# EAGLE design RelayBoard1.0 (EAGLE 7.4.0)
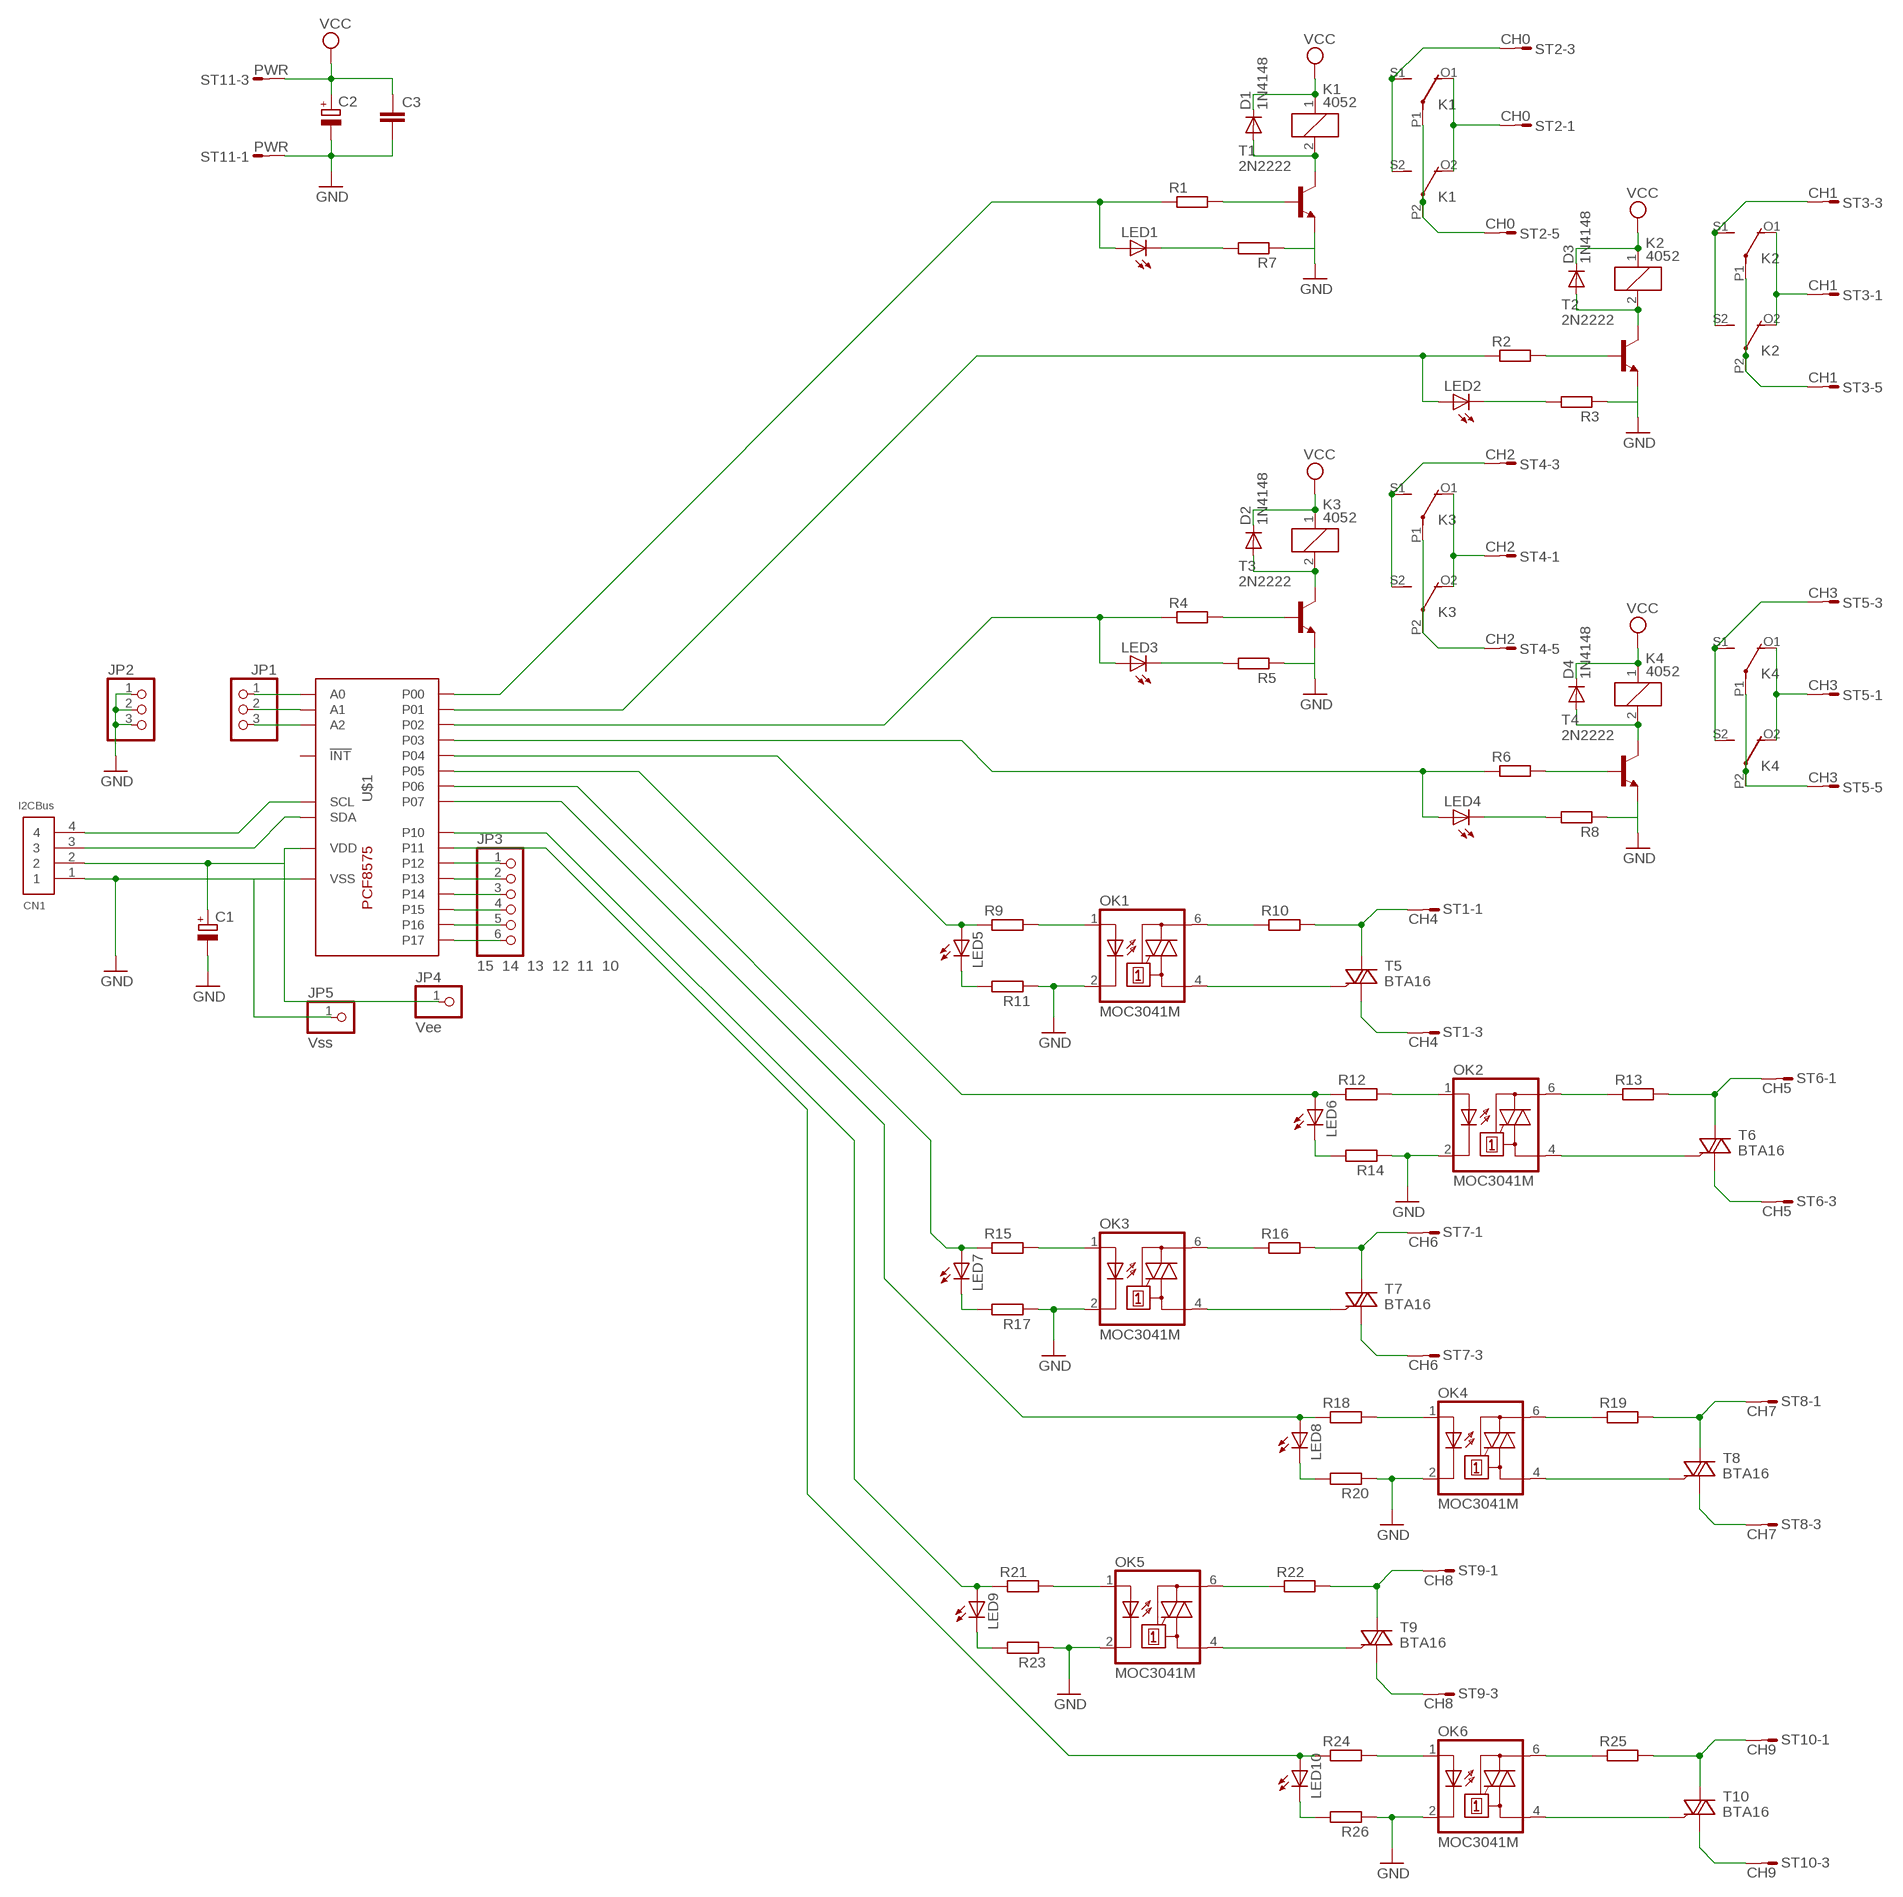
[diagram p0: schematic, sheet 1]

## Parts
C1  CPOL-EUE3.5-8  [E3,5-8]
C2  CPOL-EUE2.5-7  [E2,5-7]
C3  C-EU050-025X075  [C050-025X075]
CN1  I2CBus  1X4-BIG  [1X04-BIG]
D1  1N4148  1N4148DO35-7  [DO35-7]
D2  1N4148  1N4148DO35-7  [DO35-7]
D3  1N4148  1N4148DO35-7  [DO35-7]
D4  1N4148  1N4148DO35-7  [DO35-7]
JP1  PINHD-1X3  [1X03]
JP2  PINHD-1X3  [1X03]
JP3  15 14 13 12 11 10  PINHD-1X6CB  [1X06-CLEANBIG]
JP4  Vee  PINHD-1X1CB  [1X01-CLEANBIG]
JP5  Vss  PINHD-1X1CB  [1X01-CLEANBIG]
K1  4052  [F4052]
K2  4052  [F4052]
K3  4052  [F4052]
K4  4052  [F4052]
LED1  LED3MM  [LED3MM]
LED2  LED3MM  [LED3MM]
LED3  LED3MM  [LED3MM]
LED4  LED3MM  [LED3MM]
LED5  LEDCHIPLED_0805  [CHIPLED_0805]
LED6  LEDCHIPLED_0805  [CHIPLED_0805]
LED7  LEDCHIPLED_0805  [CHIPLED_0805]
LED8  LEDCHIPLED_0805  [CHIPLED_0805]
LED9  LEDCHIPLED_0805  [CHIPLED_0805]
LED10  LEDCHIPLED_0805  [CHIPLED_0805]
OK1  MOC3041M  [DIL06]
OK2  MOC3041M  [DIL06]
OK3  MOC3041M  [DIL06]
OK4  MOC3041M  [DIL06]
OK5  MOC3041M  [DIL06]
OK6  MOC3041M  [DIL06]
R1  R-EU_0204/7  [0204/7]
R2  R-EU_0204/7  [0204/7]
R3  R-EU_0207/2V  [0207/2V]
R4  R-EU_0204/7  [0204/7]
R5  R-EU_0207/2V  [0207/2V]
R6  R-EU_0204/7  [0204/7]
R7  R-EU_0207/2V  [0207/2V]
R8  R-EU_0207/2V  [0207/2V]
R9  R-EU_0207/2V  [0207/2V]
R10  R-EU_0207/7  [0207/7]
R11  R-EU_M0805  [M0805]
R12  R-EU_0207/2V  [0207/2V]
R13  R-EU_0207/7  [0207/7]
R14  R-EU_M0805  [M0805]
R15  R-EU_0207/2V  [0207/2V]
R16  R-EU_0207/7  [0207/7]
R17  R-EU_M0805  [M0805]
R18  R-EU_0207/2V  [0207/2V]
R19  R-EU_0207/7  [0207/7]
R20  R-EU_M0805  [M0805]
R21  R-EU_0207/2V  [0207/2V]
R22  R-EU_0207/7  [0207/7]
R23  R-EU_M0805  [M0805]
R24  R-EU_0207/2V  [0207/2V]
R25  R-EU_0207/7  [0207/7]
R26  R-EU_M0805  [M0805]
ST1  CH4  MSF3  [MSF3]
ST2  CH0  MSF5  [MSF5]
ST3  CH1  MSF5  [MSF5]
ST4  CH2  MSF5  [MSF5]
ST5  CH3  MSF5  [MSF5]
ST6  CH5  MSF3  [MSF3]
ST7  CH6  MSF3  [MSF3]
ST8  CH7  MSF3  [MSF3]
ST9  CH8  MSF3  [MSF3]
ST10  CH9  MSF3  [MSF3]
ST11  PWR  MSF3  [MSF3]
T1  2N2222  [TO92-EBC-OVAL]
T2  2N2222  [TO92-EBC-OVAL]
T3  2N2222  [TO92-EBC-OVAL]
T4  2N2222  [TO92-EBC-OVAL]
T5  BTA16  BT138-V  [TO220BV]
T6  BTA16  BT138-V  [TO220BV]
T7  BTA16  BT138-V  [TO220BV]
T8  BTA16  BT138-V  [TO220BV]
T9  BTA16  BT138-V  [TO220BV]
T10  BTA16  BT138-V  [TO220BV]
U$1  PCF8575C  [SOP24]

## Nets
GND: C1.- C2.- C3.2 CN1.1 JP2.1 JP2.2 JP2.3 JP5.1 OK1.2(C) OK2.2(C) OK3.2(C) OK4.2(C) OK5.2(C) OK6.2(C) R3.1 R5.1 R7.1 R8.1 R11.1 R14.1 R17.1 R20.1 R23.1 R26.1 ST11.1 T1.E T2.E T3.E T4.E U$1.P$12(VSS)
N$1: LED1.A R1.1 U$1.P$4(P00)
N$2: C1.+ CN1.2 JP4.1 U$1.P$24(VDD)
N$3: LED1.K(C) R7.2
N$4: LED2.A R2.1 U$1.P$5(P01)
N$5: LED2.K(C) R3.2
N$6: D3.A K2.2 T2.C
N$7: R2.2 T2.B
N$8: LED3.A R4.1 U$1.P$6(P02)
N$9: LED3.K(C) R5.2
N$10: D1.A K1.2 T1.C
N$11: D2.A K3.2 T3.C
N$12: R4.2 T3.B
N$13: R1.2 T1.B
N$14: LED4.A R6.1 U$1.P$7(P03)
N$15: LED4.K(C) R8.2
N$16: D4.A K4.2 T4.C
N$17: R6.2 T4.B
N$18: K2.O1(2:O) K2.O2(3:O) ST3.1
N$19: CN1.3 U$1.P$23(SDA)
N$20: CN1.4 U$1.P$22(SCL)
N$21: JP1.1 U$1.P$21(A0)
N$22: JP1.2 U$1.P$2(A1)
N$23: JP1.3 U$1.P$3(A2)
N$24: LED5.A R9.1 U$1.P$8(P04)
N$25: OK1.1(A) R9.2
N$26: ST1.3 T5.T1(A1)
N$27: OK1.4(A1) T5.G
N$28: OK1.6(A2) R10.1
N$29: R10.2 ST1.1 T5.T2(A2)
N$30: K1.S1(2:S) K1.S2(3:S) ST2.3
N$31: K1.P1(2:P) K1.P2(3:P) ST2.5
N$32: K1.O1(2:O) K1.O2(3:O) ST2.1
N$33: K3.P1(2:P) K3.P2(3:P) ST4.5
N$34: LED5.C R11.2
N$35: LED6.A R12.1 U$1.P$9(P05)
N$36: K3.S1(2:S) K3.S2(3:S) ST4.3
N$37: OK2.1(A) R12.2
N$38: K3.O1(2:O) K3.O2(3:O) ST4.1
N$39: OK2.4(A1) T6.G
N$40: OK2.6(A2) R13.1
N$41: K4.O1(2:O) K4.O2(3:O) ST5.1
N$42: K2.S1(2:S) K2.S2(3:S) ST3.3
N$43: K2.P1(2:P) K2.P2(3:P) ST3.5
N$44: R13.2 ST6.1 T6.T2(A2)
N$45: ST6.3 T6.T1(A1)
N$46: LED6.C R14.2
N$47: LED7.A R15.1 U$1.P$10(P06)
N$48: K4.S1(2:S) K4.S2(3:S) ST5.3
N$49: K4.P1(2:P) K4.P2(3:P) ST5.5
N$50: OK3.1(A) R15.2
N$51: OK3.4(A1) T7.G
N$52: OK3.6(A2) R16.1
N$53: R16.2 ST7.1 T7.T2(A2)
N$54: ST7.3 T7.T1(A1)
N$55: LED7.C R17.2
N$56: LED8.A R18.1 U$1.P$11(P07)
N$57: OK4.1(A) R18.2
N$58: OK4.4(A1) T8.G
N$59: OK4.6(A2) R19.1
N$60: R19.2 ST8.1 T8.T2(A2)
N$61: ST8.3 T8.T1(A1)
N$62: LED8.C R20.2
N$63: LED9.A R21.1 U$1.P$13(P10)
N$64: OK5.1(A) R21.2
N$65: OK5.4(A1) T9.G
N$66: OK5.6(A2) R22.1
N$67: R22.2 ST9.1 T9.T2(A2)
N$68: ST9.3 T9.T1(A1)
N$69: LED9.C R23.2
N$70: LED10.A R24.1 U$1.P$14(P11)
N$71: OK6.1(A) R24.2
N$72: OK6.4(A1) T10.G
N$73: OK6.6(A2) R25.1
N$74: R25.2 ST10.1 T10.T2(A2)
N$75: ST10.3 T10.T1(A1)
N$76: LED10.C R26.2
N$78: JP3.1 U$1.P$15(P12)
N$79: JP3.2 U$1.P$16(P13)
N$80: JP3.3 U$1.P$17(P14)
N$81: JP3.4 U$1.P$18(P15)
N$82: JP3.5 U$1.P$19(P16)
N$83: JP3.6 U$1.P$20(P17)
VCC: C2.+ C3.1 D1.C D2.C D3.C D4.C K1.1 K2.1 K3.1 K4.1 ST11.3
Unconnected: ST1.2 ST2.2 ST2.4 ST3.2 ST3.4 ST4.2 ST4.4 ST5.2 ST5.4 ST6.2 ST7.2 ST8.2 ST9.2 ST10.2 ST11.2 U$1.P$1(!INT)

## Library data of the parts
C1 = resistor:CPOL-EU: POLARIZED CAPACITOR, European symbol
C2 = rcl:CPOL-EU: POLARIZED CAPACITOR, European symbol
C3 = rcl:C-EU: CAPACITOR, European symbol
CN1 = adafruit:1X4: 4-pin connector
D1-D4 = diode:1N4148: DIODE high speed (Philips)
JP1 JP2 = adafruit:PINHD-1X3: PIN HEADER
JP3 = adafruit:PINHD-1X6: PIN HEADER
JP4 JP5 = adafruit:PINHD-1X1: Pin header 1x1 for 0.1" spacing With round pins
K1-K4 = relay:4052: RELAY 2 x switch, Finder; OC_FARNELL: unknown; OC_NEWARK: unknown
LED1-LED10 = adafruit:LED: LED OSRAM: - CHIPLED LG R971, LG N971, LY N971, LG Q971, LY Q971, LO R971, LY R971 LH N974, LH R974 LS Q976, LO Q976, LY Q976 LO Q996 - Hyper CHIPLED LW Q18S LB Q993, LB Q99A, LB R99A - SideLED LS A670, LO A670, LY A670, LG A670, LP A670 LB A673, LV A673, LT A673, LW A673 LH A674 LY A675 LS A676, LA A676, LO A676, LY A676, LW A676 LS A679, LY A679, LG A679 - Hyper Micro SIDELED® LS Y876, LA Y876, LO Y876, LY Y876 LT Y87S - SmartLED LW L88C, LW L88S LB L89C, LB L89S, LG L890 LS L89K, LO L89K, LY L89K LS L896, LA L896, LO L896, LY L896 - TOPLED LS T670, LO T670, LY T670, LG T670, LP T670 LSG T670, LSP T670, LSY T670, LOP T670, LYG T670 LG T671, LOG T671, LSG T671 LB T673, LV T673, LT T673, LW T673 LH T674 LS T676, LA T676, LO T676, LY T676, LB T676, LH T676, LSB T676, LW T676 LB T67C, LV T67C, LT T67C, LS T67K, LO T67K, LY T67K, LW E67C LS E67B, LA E67B, LO E67B, LY E67B, LB E67C, LV E67C, LT E67C LW T67C LS T679, LY T679, LG T679 LS T770, LO T770, LY T770, LG T770, LP T770 LB T773, LV T773, LT T773, LW T773 LH T774 LS E675, LA E675, LY E675, LS T675 LS T776, LA T776, LO T776, LY T776, LB T776 LHGB T686 LT T68C, LB T68C - Hyper Mini TOPLED® LB M676 - Mini TOPLED Santana® LG M470 LS M47K, LO M47K, LY M47K Source: http://www.osram.convergy.de/
OK1-OK6 = optocoupler:MOC30*: 6-Pin DIP Zero-Cross Optoisolators Triac Driver Output (250/400 Volt Peak) Source: Data sheet <http://www.fairchildsemi.com/ds/MO/MOC3031M.pdf> The old path of data sheet not more available 2013-05-06.; MF: FAIRCHILD SEMICONDUCTOR; MPN: MOC3041M; OC_FARNELL: 1086677; OC_NEWARK: 78K6090
R1-R26 = rcl:R-EU_: RESISTOR, European symbol
ST1 ST6-ST11 = con-lumberg:MSF3: MSF CONNECTOR; OC_FARNELL: unknown; OC_NEWARK: unknown
ST2-ST5 = con-lumberg:MSF5: MSF CONNECTOR; OC_FARNELL: unknown; OC_NEWARK: unknown
T1-T4 = adafruit:2N2222: NPN TRANSISTOR Big oval pads
T5-T10 = triac:BT138: TRIAC Source: http://www.semiconductors.philips.com BT138_SERIES_2.pdf
U$1 = pcf8575c:PCF8575C

## Board
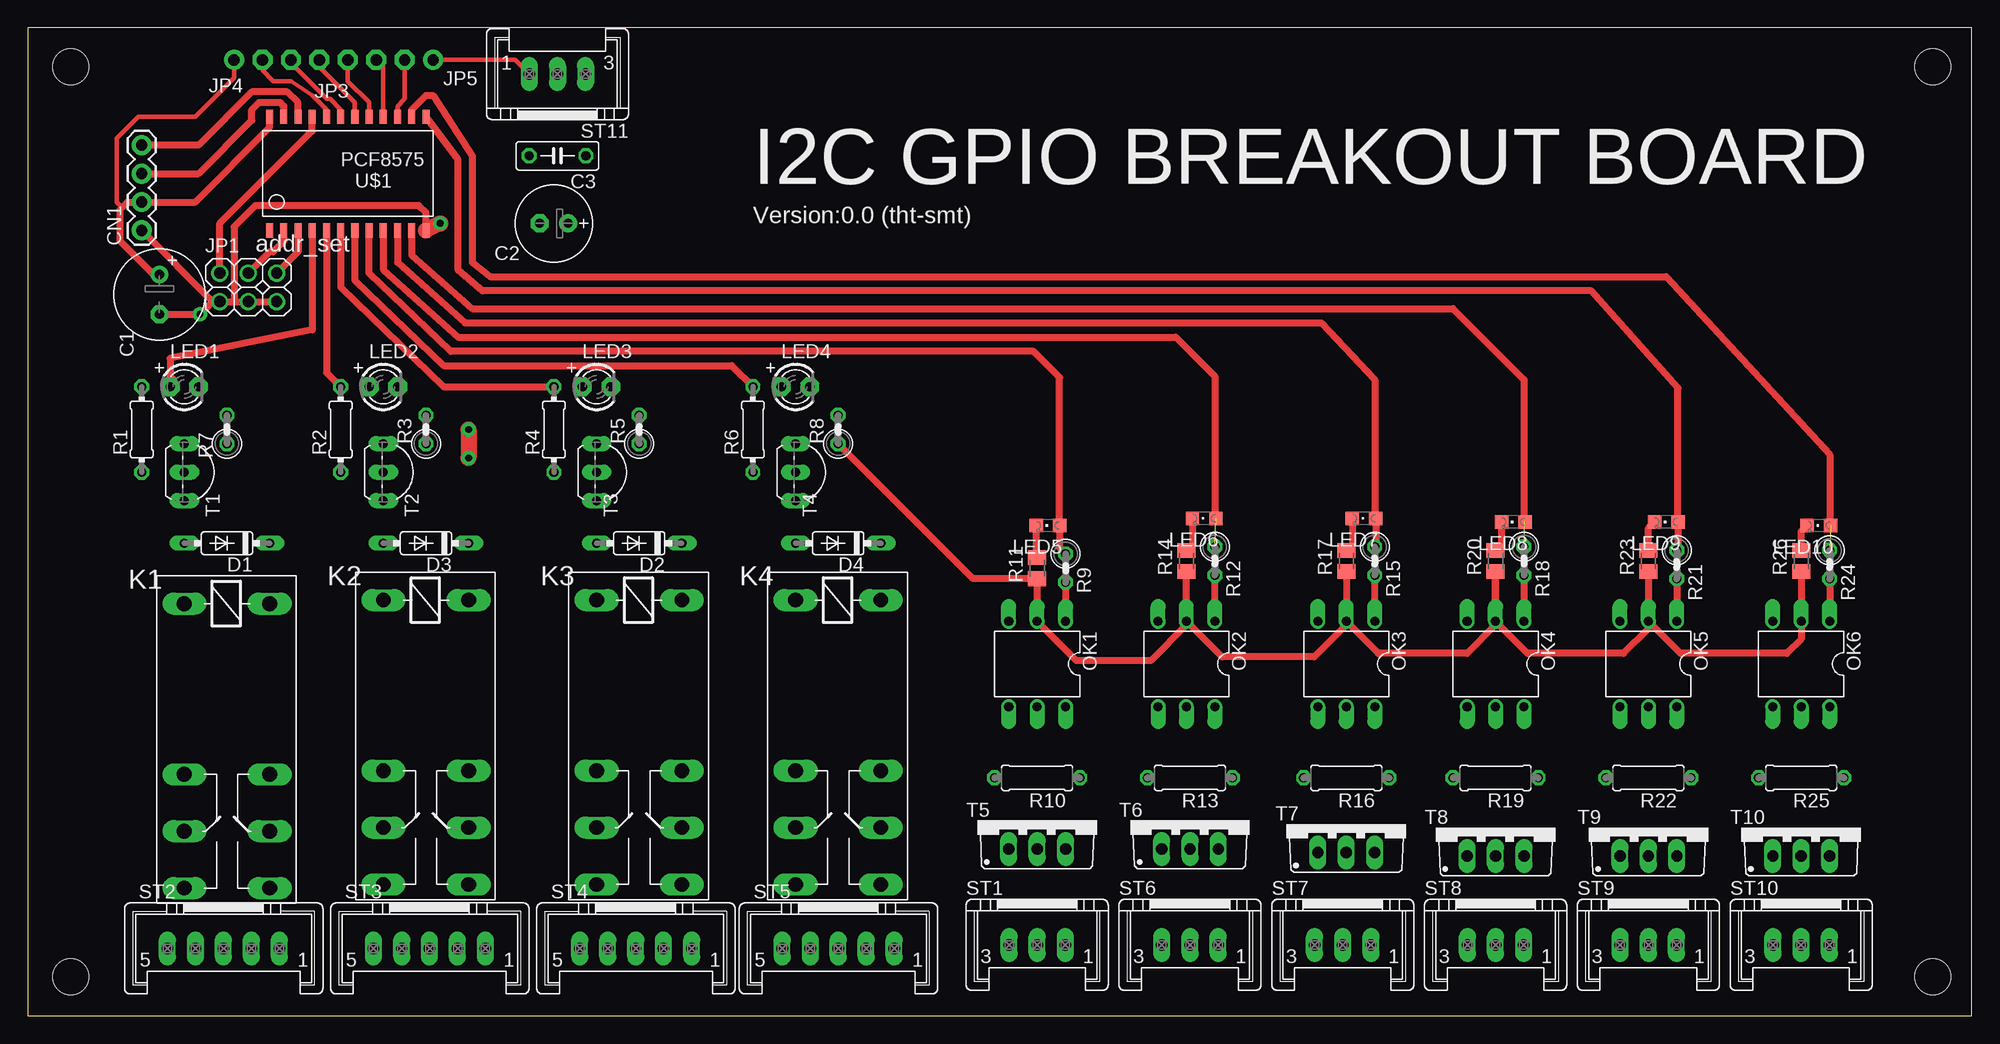
[diagram p1: board, top side]
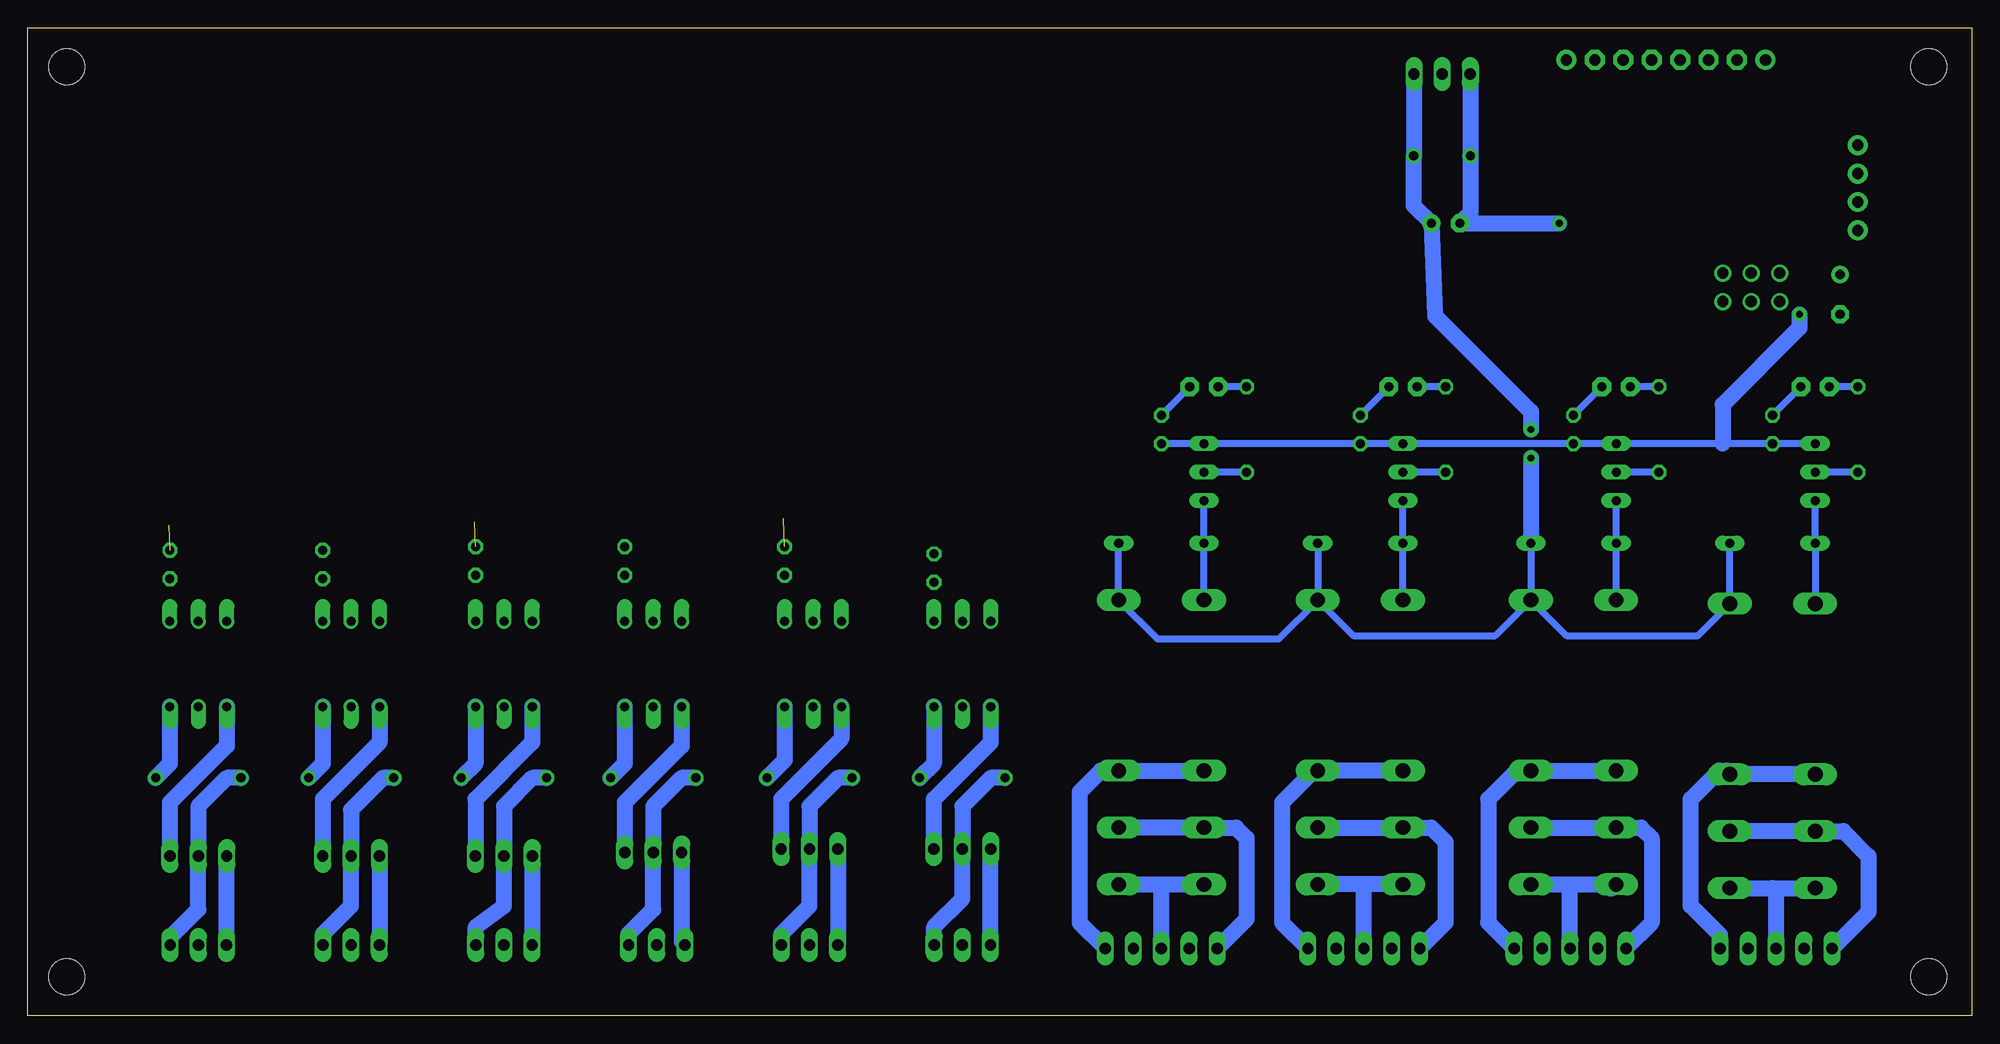
[diagram p2: board, bottom side, seen from below]

Size 173.65 x 88.25 mm. Coordinates in mm from the lower left corner, seen from the top.
Outline: 0,0 173.65,0 173.65,88.25 0,88.25 0,0
Copper layers (1*16): Top 0.035mm / dielectric 1.5mm / Bottom 0.035mm
Design rules "default": minimum track width 10mil, minimum drill 24mil, track to track 8mil, track to pad 8mil, pad to pad 8mil, via to via 8mil, smd to smd 8mil, copper to edge 40mil, drill to drill 8mil, minimum pad ring 10mil, minimum via ring 8mil, stop-mask expansion 4mil, vias tented up to drill 0mil, thermal gap 10mil
Holes 3.2 mm at 3.81,84.77 3.81,3.49 170.18,84.77 170.18,3.49

### Footprints (pad centres in the part's own frame; a part is rotated, then mirrored left to right if it is on the bottom)
E3,5-8 = drill 0.813 pad 1.6: + -1.778,0 | drill 0.813 pad 1.6 octagon: - 1.778,0
E2,5-7 = drill 0.813 pad 1.6: + -1.27,0 | drill 0.813 pad 1.6 octagon: - 1.27,0
C050-025X075 = drill 0.813 octagon: 1 -2.54,0; 2 2.54,0
1X04-BIG = drill 1.016 pad 1.778: 1 0,0; 2 2.54,0; 3 5.08,0; 4 7.62,0
DO35-7 = drill 0.813 long: A 3.81,0; C -3.81,0
1X03 = drill 1.016: 1 -2.54,0; 2 0,0; 3 2.54,0
1X06-CLEANBIG = drill 1.016 pad 1.778 octagon: 1 -6.35,0; 2 -3.81,0; 3 -1.27,0; 4 1.27,0; 5 3.81,0; 6 6.35,0
1X01-CLEANBIG = drill 1.016 pad 1.778: 1 0,0
F4052 = drill 1.321 long: 1 -3.81,3.81; 2 -3.81,-3.81; O1 11.43,-3.81; O2 11.43,3.81; P1 16.51,-3.81; P2 16.51,3.81; S1 21.59,-3.81; S2 21.59,3.81
LED3MM = drill 0.813 pad 1.676 octagon: A -1.27,0; K 1.27,0
CHIPLED_0805 = smd 1.2 x 1.2: A 0,-1.05; C 0,1.05
DIL06 = drill 0.813 offset: 1 -2.54,-3.81; 2 0,-3.81; 3 2.54,-3.81; 4 2.54,3.81; 5 0,3.81; 6 -2.54,3.81
0204/7 = drill 0.813 octagon: 1 -3.81,0; 2 3.81,0
0207/2V = drill 0.813 octagon: 1 -1.27,0; 2 1.27,0
0207/7 = drill 0.813 octagon: 1 -3.81,0; 2 3.81,0
M0805 = smd 1.3 x 1.6: 1 -0.95,0; 2 0.95,0
MSF3 = drill 1.016 long: 1 2.515,-2.54; 2 0,-2.54; 3 -2.515,-2.54
MSF5 = drill 1.016 long: 1 5.004,-2.54; 2 2.489,-2.54; 3 0,-2.54; 4 -2.489,-2.54; 5 -5.004,-2.54
TO92-EBC-OVAL = drill 0.813 long: B 0,-1.27; C 2.54,-1.27; E -2.54,-1.27
TO220BV = drill 1.016 long: G 2.54,-2.54; T1 -2.54,-2.54; T2 0,-2.54
SOP24 = smd 1.27 x 0.635: P$1 -1.27,14.605; P$2 -1.27,13.335; P$3 -1.27,12.065; P$4 -1.27,10.795; P$5 -1.27,9.525; P$6 -1.27,8.255; P$7 -1.27,6.985; P$8 -1.27,5.715; P$9 -1.27,4.445; P$10 -1.27,3.175; P$11 -1.27,1.905; P$12 -1.27,0.635; P$13 8.89,0.635; P$14 8.89,1.905; P$15 8.89,3.175; P$16 8.89,4.445; P$17 8.89,5.715; P$18 8.89,6.985; P$19 8.89,8.255; P$20 8.89,9.525; P$21 8.89,10.795; P$22 8.89,12.065; P$23 8.89,13.335; P$24 8.89,14.605

### Placement (x,y rotation side)
C1  11.75,64.45 270 top
C2  46.99,70.8 180 top
C3  47.31,76.83 180 top
CN1  10.16,70.17 90 top
D1  17.78,42.23 180 top
D2  54.61,42.23 180 top
D3  35.56,42.23 180 top
D4  72.39,42.23 180 top
JP1  19.68,66.36 0 top
JP2  19.68,63.82 180 top
JP3  27.3,85.41 180 top
JP4  18.41,85.41 0 top
JP5  36.2,85.41 0 top
K1  17.78,33.02 270 top
K2  35.56,33.34 270 top
K3  54.61,33.34 270 top
K4  72.39,33.34 270 top
LED1  13.97,56.2 0 top
LED2  31.75,56.2 0 top
LED3  50.8,56.2 0 top
LED4  68.58,56.2 0 top
LED5  91.12,43.81 90 top
LED6  105.09,44.45 90 top
LED7  119.38,44.45 90 top
LED8  132.72,44.13 90 top
LED9  146.37,44.13 90 top
LED10  160.02,43.81 90 top
OK1  90.17,31.43 180 top
OK2  103.5,31.43 180 top
OK3  117.79,31.43 180 top
OK4  131.13,31.43 180 top
OK5  144.78,31.43 180 top
OK6  158.43,31.43 180 top
R1  10.16,52.39 270 top
R2  27.94,52.39 270 top
R3  35.56,52.39 90 top
R4  46.99,52.39 270 top
R5  54.61,52.39 90 top
R6  64.77,52.39 270 top
R7  17.78,52.39 90 top
R8  72.39,52.39 90 top
R9  92.71,40 270 top
R10  90.17,21.27 180 top
R11  90.17,40 90 top
R12  106.05,40.64 270 top
R13  103.82,21.27 180 top
R14  103.5,40.64 90 top
R15  120.33,40.64 270 top
R16  117.79,21.27 180 top
R17  117.79,40.64 90 top
R18  133.67,40.64 270 top
R19  131.13,21.27 180 top
R20  131.13,40.64 90 top
R21  147.32,40.32 270 top
R22  144.78,21.27 180 top
R23  144.78,40.64 90 top
R24  160.97,40.32 270 top
R25  158.43,21.27 180 top
R26  158.43,40.64 90 top
ST1  90.17,8.89 0 top
ST2  17.46,8.57 0 top
ST3  35.88,8.57 0 top
ST4  54.29,8.57 0 top
ST5  72.39,8.57 0 top
ST6  103.82,8.89 0 top
ST7  117.47,8.89 0 top
ST8  131.13,8.89 0 top
ST9  144.78,8.89 0 top
ST10  158.43,8.89 0 top
ST11  47.31,81.6 180 top
T1  15.24,48.58 270 top
T2  33.02,48.58 270 top
T3  52.07,48.58 270 top
T4  69.85,48.58 270 top
T5  90.17,17.46 0 top
T6  103.82,17.46 0 top
T7  117.79,17.14 0 top
T8  131.13,16.83 0 top
T9  144.78,16.83 0 top
T10  158.43,16.83 0 top
U$1  36.2,71.44 90 top

### Tracks (layer width: path | path; a pad name or v marks a point on that pad's centre or on a via)
GND  (via drill 0.6 pad 1.27)
  Top 0.406: JP5.1 43.52,85.41 ST11.1
  Top 0.61: 16.51,63.82 JP2.3 18.41,63.82 | 16.51,63.82 CN1.1 | 18.41,63.82 JP2.2 JP2.1 | U$1.P$12 35.56,71.75 34.92,72.39 20.32,72.39 18.41,70.49 18.41,63.82 | C1.- v15.37,62.67 16.51,63.82 | R8.1 84.45,39.05 R11.1 OK1.2 93.66,31.75 100.33,31.75 103.5,34.93 OK2.2 | OK2.2 R14.1 | R26.1 OK6.2 158.43,33.65 157.16,32.39 147.64,32.39 OK5.2 R23.1 144.78,34.61 142.56,32.39 133.99,32.39 OK4.2 R20.1 131.13,34.93 128.59,32.39 120.65,32.39 OK3.2 R17.1 117.79,34.93 114.94,32.07 106.68,32.07 OK2.2
  Top 1.422: v36.83,70.8 U$1.P$12
  Bottom 0.61: T1.E R7.1 22.23,51.12 T2.E R3.1 T3.E R5.1 T4.E R8.1
  Bottom 1.422: ST11.1 44.79,76.86 C3.2 44.77,71.75 C2.- v36.83,70.8 | v15.37,62.67 15.37,61.47 22.23,54.61 22.23,51.12
N$1
  Top 0.61: U$1.P$4 25.4,61.28 12.7,58.74 12.7,57.15 13.02,56.83 13.02,56.51 LED1.A
  Bottom 0.61: R1.1 LED1.A
N$2
  Top 0.406: JP4.1 18.41,83.82 14.92,80.33 9.84,80.33 7.94,78.42 7.94,72.71 8.41,72.23
  Top 0.61: U$1.P$24 21.59,79.38 14.92,72.71 CN1.2 8.89,72.71 8.41,72.23 8.26,72.07 8.26,69.21 11.24,66.23 C1.+
N$3
  Bottom 0.61: LED1.K R7.2
N$4
  Top 0.61: U$1.P$5 26.67,57.47 R2.1
  Bottom 0.61: R2.1 LED2.A
N$5
  Bottom 0.61: LED2.K R3.2
N$6
  Bottom 0.61: K2.2 D3.A T2.C
N$7
  Bottom 0.61: R2.2 T2.B
N$8
  Top 0.61: U$1.P$6 27.94,65.09 37.15,56.2 R4.1
  Bottom 0.61: R4.1 LED3.A
N$9
  Bottom 0.61: LED3.K R5.2
N$10
  Bottom 0.61: K1.2 D1.A T1.C
N$11
  Bottom 0.61: K3.2 D2.A T3.C
N$12
  Bottom 0.61: R4.2 T3.B
N$13
  Bottom 0.61: R1.2 T1.B
N$14
  Top 0.61: U$1.P$7 29.21,65.72 37.15,58.1 62.87,58.1 R6.1
  Bottom 0.61: R6.1 LED4.A
N$15
  Bottom 0.61: LED4.K R8.2
N$16
  Bottom 0.61: K4.2 D4.A T4.C
N$17
  Bottom 0.61: R6.2 T4.B
N$18
  Bottom 1.422: K2.O1 K2.O2 40.64,21.91 43.18,19.37 43.18,8.33 ST3.1
N$19
  Top 0.61: CN1.3 15.24,75.25 20,80.01 20,80.96 20.64,81.6 22.54,81.6 22.86,81.28 U$1.P$23
N$20
  Top 0.61: U$1.P$22 24.13,81.6 23.18,82.55 20,82.55 15.24,77.79 CN1.4
N$21
  Top 0.61: JP1.1 17.14,70.8 25.4,79.06 U$1.P$21
N$22
  Top 0.61: U$1.P$2 22.86,69.21 21.91,68.26 21.59,68.26 JP1.2
N$23
  Top 0.61: U$1.P$3 24.13,68.26 JP1.3
N$24
  Top 0.61: R9.1 92.17,41.81 LED5.A 92.17,57.05 89.85,59.37 37.78,59.37 30.48,66.36 U$1.P$8
N$25
  Top 0.61: R9.2 OK1.1
N$26
  Bottom 1.422: ST1.3 87.66,14.9 T5.T1
N$27
  Bottom 1.422: T5.G 92.71,19.37 87.63,24.45 OK1.4
N$28
  Bottom 1.422: OK1.6 92.71,22.54 R10.1
N$29
  Bottom 1.422: ST1.1 92.69,7.96 90.17,10.48 T5.T2 90.17,18.73 87.63,21.27 R10.2
N$30
  Bottom 1.422: K1.S2 17.78,11.43 | 17.78,11.43 K1.S1 | ST2.3 17.46,11.11 17.78,11.43
N$31
  Bottom 1.422: K1.P2 K1.P1 11.43,16.51 9.21,14.29 9.21,9.28 ST2.5
N$32
  Bottom 1.422: K1.O1 K1.O2 21.91,21.91 22.54,21.91 25.08,19.37 25.08,9.84 22.47,7.23 ST2.1
N$33
  Bottom 1.422: K3.P2 K3.P1 48.26,16.83 46.99,15.56 46.99,8.33 ST4.5
N$34
  Top 0.61: LED5.C 90.07,41.5 89.85,41.28 89.85,41.27 R11.2
N$35  (1 unrouted)
  Top 0.61: U$1.P$9 31.75,66.68 38.42,60.64 102.55,60.64 106.05,57.15 106.05,44.55 LED6.A
N$36
  Bottom 1.422: K3.S1 54.29,11.75 | 54.29,11.75 K3.S2 | ST4.3 54.29,11.75
N$37
  Top 0.61: OK2.1 R12.2
N$38
  Bottom 1.422: K3.O1 K3.O2 58.74,21.91 61.59,19.05 61.59,8.33 ST4.1
N$39
  Bottom 1.422: OK2.4 100.97,24.77 106.36,19.37 T6.G
N$40
  Bottom 1.422: OK2.6 106.05,22.86 R13.1
N$41
  Bottom 1.422: K4.O1 K4.O2 77.79,21.91 79.69,20 79.69,8.33 ST5.1
N$42
  Bottom 1.422: K2.S2 35.88,11.75 | 35.88,11.75 32.7,11.75 32.38,11.43 32.07,11.43 K2.S1 | ST3.3 35.88,11.75
N$43
  Bottom 1.422: K2.P2 K2.P1 29.53,16.83 28.57,15.88 28.57,8.33 ST3.5
N$44
  Bottom 1.422: ST6.1 106.34,7.33 103.82,9.84 T6.T2 103.82,18.73 101.28,21.27 R13.2
N$45
  Bottom 1.422: T6.T1 101.28,6.38 ST6.3
N$46
  Top 0.61: LED6.C 104.04,42.13 R14.2
N$47
  Top 0.61: R15.1 120.43,42.01 LED7.A 120.33,44.55 120.33,56.83 115.57,61.91 39.05,61.91 33.02,67.31 U$1.P$10
N$48
  Bottom 1.422: K4.S2 72.39,11.75 | 72.39,11.75 K4.S1 | ST5.3 72.39,11.75
N$49
  Bottom 1.422: K4.P2 K4.P1 65.72,16.83 64.77,15.88 64.77,8.65 ST5.5
N$50
  Top 0.61: OK3.1 R15.2
N$51
  Bottom 1.422: OK3.4 115.25,24.13 120.33,19.05 T7.G
N$52
  Bottom 1.422: OK3.6 120.33,22.54 R16.1
N$53
  Bottom 1.422: ST7.1 119.99,7.33 117.79,9.52 T7.T2 117.79,18.73 115.25,21.27 R16.2
N$54
  Bottom 1.422: T7.T1 115.25,6.64 ST7.3
N$55
  Top 0.61: LED7.C 118.33,42.13 R17.2
N$56  (1 unrouted)
  Top 0.61: U$1.P$11 34.29,67.94 39.69,63.18 127.32,63.18 133.67,56.83 133.67,44.23 LED8.A
N$57
  Top 0.61: R18.2 OK4.1
N$58
  Bottom 1.422: OK4.4 128.59,24.45 133.67,19.37 T8.G
N$59
  Bottom 1.422: OK4.6 133.67,22.54 R19.1
N$60
  Bottom 1.422: ST8.1 133.64,7.96 131.13,9.84 T8.T2 131.13,18.73 128.59,21.27 R19.2
N$61
  Bottom 1.422: T8.T1 128.59,6.38 ST8.3
N$62
  Top 0.61: LED8.C 131.66,42.13 R20.2
N$63
  Top 0.61: R21.1 147.42,41.69 LED9.A 147.42,56.1 139.7,64.77 40.64,64.77 38.42,66.68 38.42,76.52 U$1.P$13
N$64
  Top 0.61: R21.2 OK5.1
N$65
  Bottom 1.422: OK5.4 142.24,24.45 147.32,19.37 T9.G
N$66
  Bottom 1.422: OK5.6 147.32,22.54 R22.1
N$67
  Bottom 1.422: ST9.1 147.29,7.33 144.78,9.84 T9.T2 144.78,18.41 141.92,21.27 R22.2
N$68
  Bottom 1.422: T9.T1 142.24,6.38 ST9.3
N$69
  Top 0.61: R23.2 144.78,43.6 LED9.C
N$70  (1 unrouted)
  Top 0.61: U$1.P$14 34.29,80.96 35.56,82.23 36.2,82.23 39.69,76.83 39.69,67.31 41.27,66.04 146.37,66.04 160.97,50.17 160.97,43.91 LED10.A
N$71
  Top 0.61: R24.2 OK6.1
N$72
  Bottom 1.422: OK6.4 155.89,24.13 160.97,19.05 T10.G
N$73
  Bottom 1.422: OK6.6 160.97,22.54 R25.1
N$74
  Bottom 1.422: ST10.1 160.95,7.01 158.43,9.52 T10.T2 158.43,18.73 155.89,21.27 R25.2
N$75
  Bottom 1.422: ST10.3 155.92,14.26 T10.T1
N$76
  Top 0.61: R26.2 158.43,43.28 LED10.C
N$78
  Top 0.406: JP3.1 33.66,81.91 33.02,81.28 U$1.P$15
N$79
  Top 0.406: U$1.P$16 31.75,84.77 JP3.2
N$80
  Top 0.406: JP3.3 28.57,83.5 30.48,81.6 U$1.P$17
N$81
  Top 0.406: JP3.4 26.04,84.77 29.21,81.6 U$1.P$18
N$82
  Top 0.406: JP3.5 23.5,85.09 26.67,81.91 26.99,81.91 27.94,80.96 U$1.P$19
N$83
  Top 0.406: U$1.P$20 26.67,80.96 25.4,82.23 23.5,83.5 21.91,83.5 20.95,84.46 JP3.6
VCC  (via drill 0.6 pad 1.27)
  Top 1.422: v39.37,52.39 v39.37,49.85
  Bottom 0.61: D1.C K1.1 24.45,33.97 36.2,33.97 K2.1 | D4.C K4.1 72.71,33.65 61.91,33.65 K3.1 | D2.C K3.1 | K3.1 55.24,33.97 42.55,33.97 K2.1 | D3.C K2.1
  Bottom 1.422: ST11.3 49.82,76.86 C3.1 49.85,72.39 C2.+ 47.94,62.55 39.37,53.97 v39.37,52.39 | v39.37,49.85 D3.C

### Text on the board
tNames: I2C GPIO BREAKOUT BOARD | Version:0.0 (tht-smt) | addr_set